# Altium schematic sheet uC.SchDoc: uC
size A3; DrawnBy: MAC; Revision: 0; Project: FotoKite; DrwanWhen: Nov.2013; CheckedWhen: When?
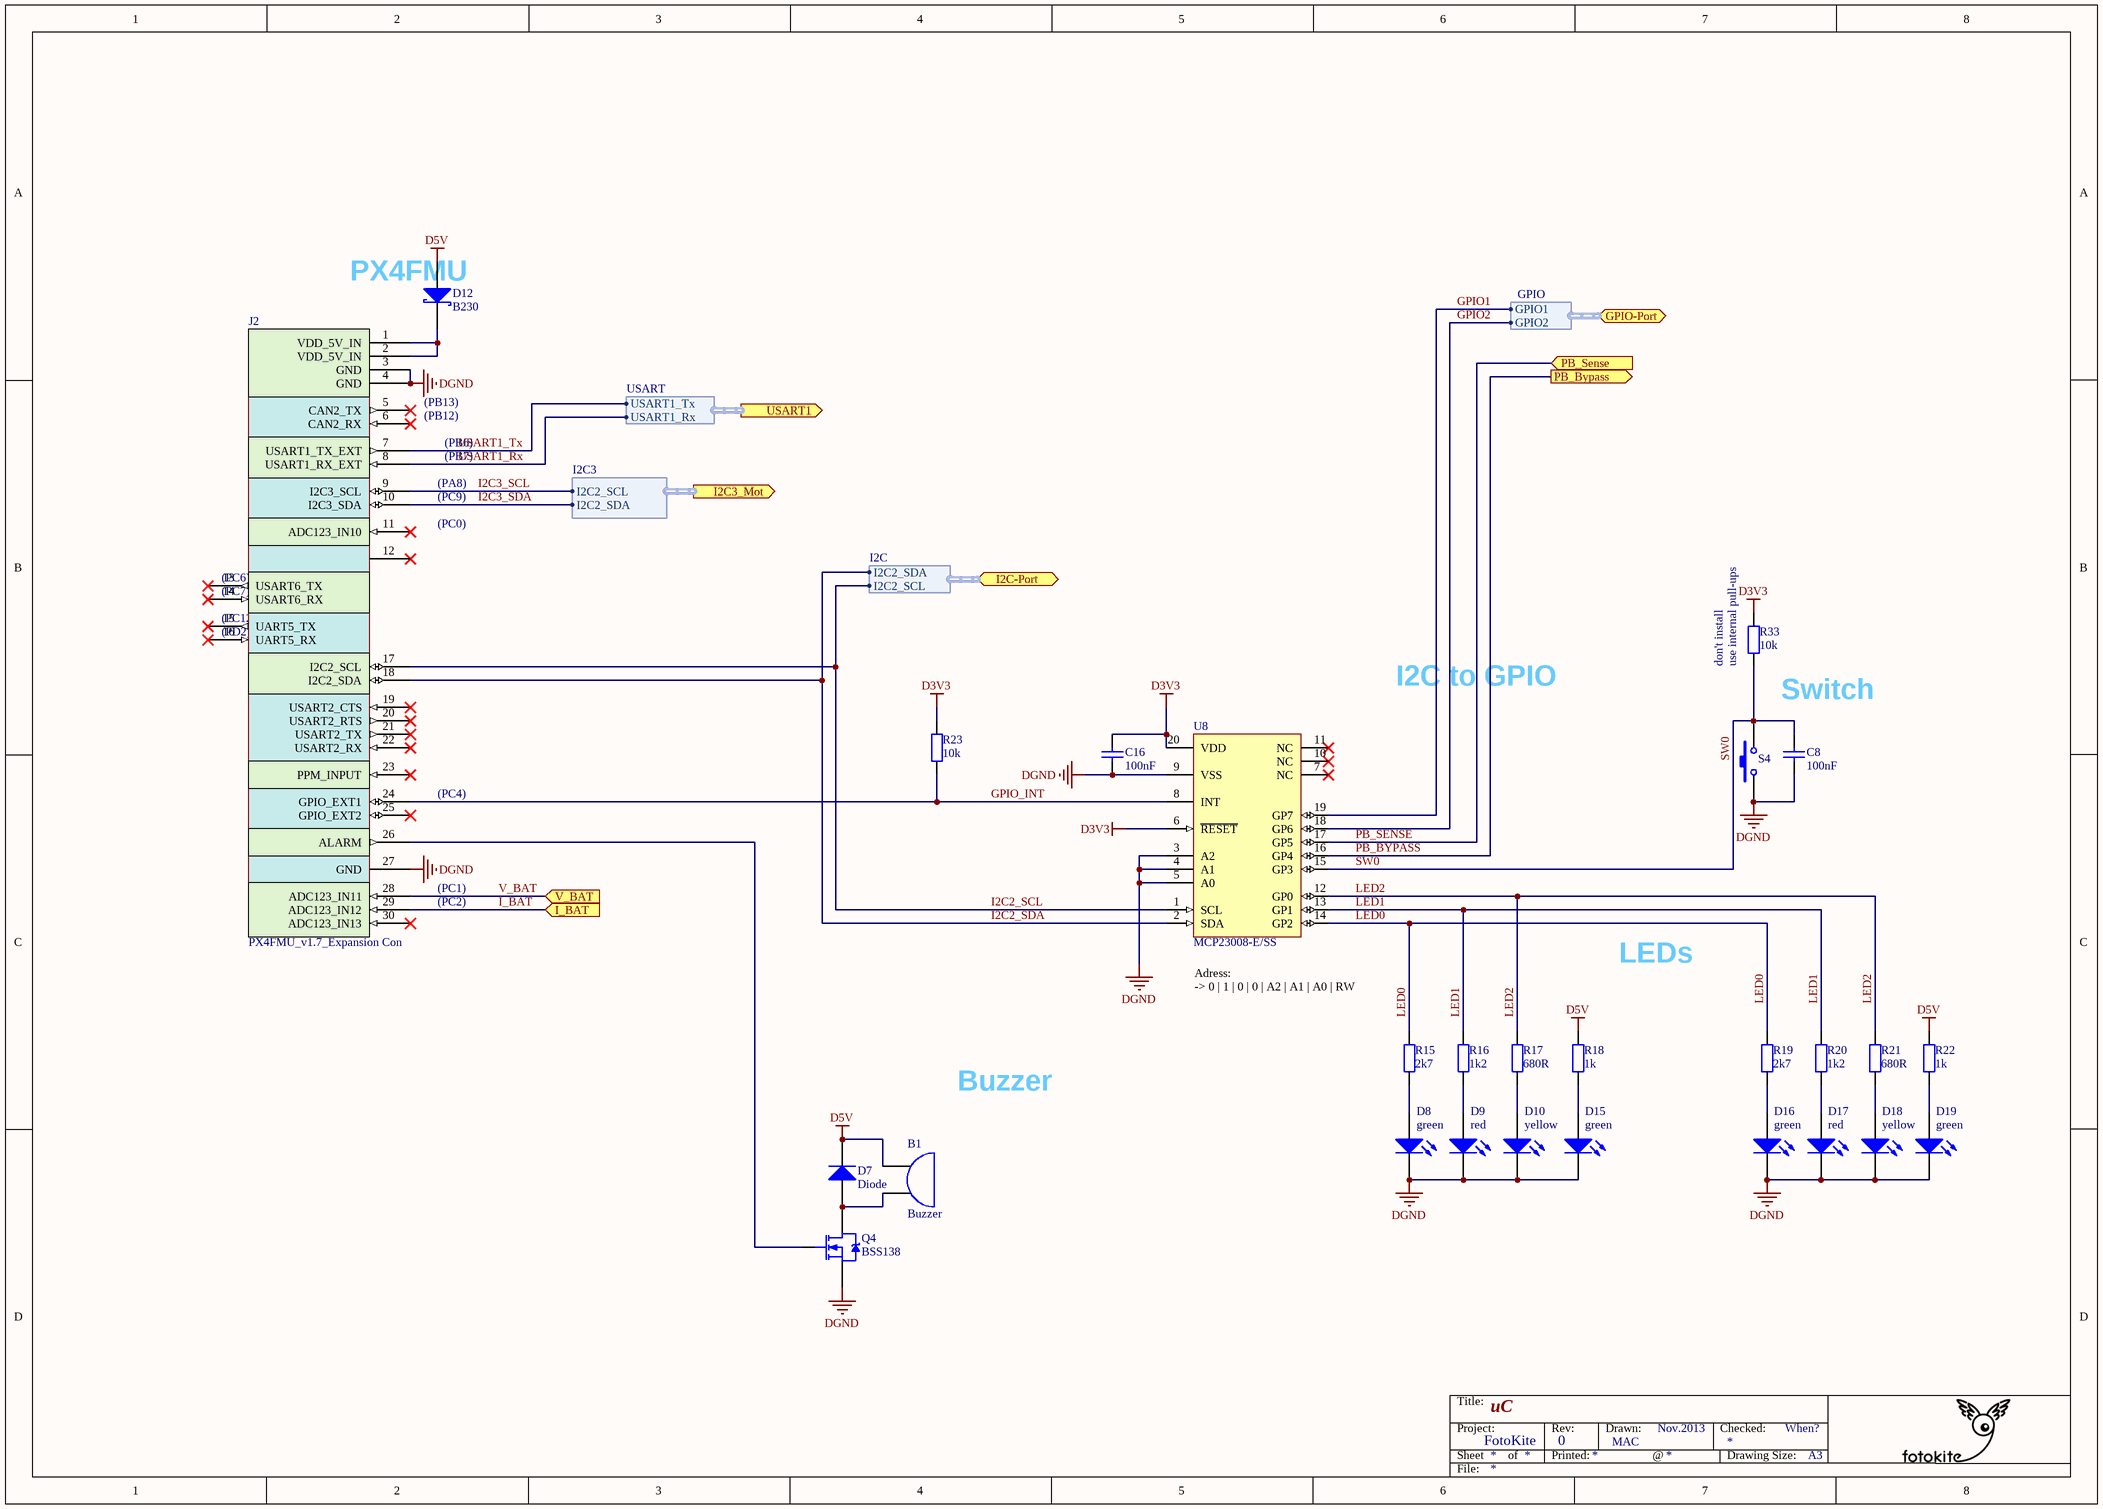
[diagram p0: uC.SchDoc]

## Parts
B1  Buzzer  [Buzzer_SMT-0827-SW-3V-R]
C8  100nF  [CAP_0603i_1608m -N]
C16  100nF  [CAP_0603i_1608m -N]
D7  Diode  [Mini MELF - SOD-80 -N]
D8  Colour: green  [LED_LTST_SIDE]  (hidden comment: Diode LED green)
D9  Colour: red  [LED_LTST_SIDE]  (hidden comment: Diode LED red)
D10  Colour: yellow  [LED_LTST_SIDE]  (hidden comment: Diode LED yellow)
D12  B230  [Diode SMB DO-214aa -N]
D15  Colour: green  [LED_LTST_SIDE]  (hidden comment: Diode LED green)
D16  Colour: green  [LED_LTST_SIDE]  (hidden comment: Diode LED green)
D17  Colour: red  [LED_LTST_SIDE]  (hidden comment: Diode LED red)
D18  Colour: yellow  [LED_LTST_SIDE]  (hidden comment: Diode LED yellow)
D19  Colour: green  [LED_LTST_SIDE]  (hidden comment: Diode LED green)
J2  PX4FMU_v1.7_Expansion Con  [PX4FMU_v1.7_module_sicket]
Q4  BSS138  [SOT23-N]
R15  2k7  [RES_0603i_1608m -N]
R16  1k2  [RES_0603i_1608m -N]
R17  680R  [RES_0603i_1608m -N]
R18  1k  [RES_0603i_1608m -N]
R19  2k7  [RES_0603i_1608m -N]
R20  1k2  [RES_0603i_1608m -N]
R21  680R  [RES_0603i_1608m -N]
R22  1k  [RES_0603i_1608m -N]
R23  10k  [RES_0603i_1608m -N]
R33  10k  Note: don't install  Note2: use internal pull-ups  [RES_0603i_1608m -N]
S4  EVQ-PUB02K  [EVQPU]  (value not drawn)
U8  MCP23008-E/SS  [SSOP-SS20_N]

## Ports
GPIO-Port (harness GPIO), I2C3_Mot (harness I2C3), I2C-Port (harness I2C), I_BAT (in), PB_Bypass (out), PB_Sense, USART1 (harness USART), V_BAT (in)

## Harnesses
I2C3: I2C2_SCL, I2C2_SDA
GPIO: GPIO1, GPIO2
I2C: I2C2_SCL, I2C2_SDA
USART: USART1_Tx, USART1_Rx

## Nets
D3V3: C16.1 R23.2 R33.2 U8.6(~{RESET}) U8.20(VDD)
D5V: B1.1 D7.2(K) D12.1(A) R18.2 R22.2
DGND: C8.1 C16.2 D8.2(K) D9.2(K) D10.2(K) D15.2(K) D16.2(K) D17.2(K) D18.2(K) D19.2(K) J2.3(GND) J2.4(GND) J2.27(GND) Q4.2(S) S4.2 U8.3(A2) U8.4(A1) U8.5(A0) U8.9(VSS)
GPIO1: U8.19(GP7) ; port GPIO-Port.GPIO1
GPIO2: U8.18(GP6) ; port GPIO-Port.GPIO2
GPIO_INT: J2.24(GPIO_EXT1) R23.1 U8.8(INT)
I2C2_SCL: J2.17(I2C2_SCL) U8.1(SCL) ; port I2C-Port.I2C2_SCL
I2C2_SDA: J2.18(I2C2_SDA) U8.2(SDA) ; port I2C-Port.I2C2_SDA
I2C3_SCL: J2.9(I2C3_SCL) ; port I2C3_Mot.I2C2_SCL
I2C3_SDA: J2.10(I2C3_SDA) ; port I2C3_Mot.I2C2_SDA
I_BAT: J2.29(ADC123_IN12) ; port I_BAT
LED0: R15.2 R19.2 U8.14(GP2)
LED1: R16.2 R20.2 U8.13(GP1)
LED2: R17.2 R21.2 U8.12(GP0)
PB_BYPASS: U8.16(GP4) ; port PB_Bypass
PB_SENSE: U8.17(GP5) ; port PB_Sense
SW0: C8.2 R33.1 S4.1 U8.15(GP3)
USART1_Rx: J2.8(USART1_RX_EXT) ; port USART1.USART1_Rx
USART1_Tx: J2.7(USART1_TX_EXT) ; port USART1.USART1_Tx
V_BAT: J2.28(ADC123_IN11) ; port V_BAT
NetB1_2: B1.2 D7.1(A) Q4.3(D)
NetD8_1: D8.1(A) R15.1
NetD9_1: D9.1(A) R16.1
NetD10_1: D10.1(A) R17.1
NetD12_2: D12.2(K) J2.1(VDD_5V_IN) J2.2(VDD_5V_IN)
NetD15_1: D15.1(A) R18.1
NetD16_1: D16.1(A) R19.1
NetD17_1: D17.1(A) R20.1
NetD18_1: D18.1(A) R21.1
NetD19_1: D19.1(A) R22.1
NetJ2_26: J2.26(ALARM) Q4.1(G)

Not connected (* = marked no-connect by the designer): J2 5(CAN2_TX)* 6(CAN2_RX)* 11(ADC123_IN10)* 12* 13(USART6_TX)* 14(USART6_RX)* 15(UART5_TX)* 16(UART5_RX)* 19(USART2_CTS)* 20(USART2_RTS)* 21(USART2_TX)* 22(USART2_RX)* 23(PPM_INPUT)* 25(GPIO_EXT2)* 30(ADC123_IN13)*; U8 7(NC)* 10(NC)* 11(NC)*

## Notes on the sheet
- PX4FMU
- (near J2) (PB13)
- (near J2) (PB12)
- (near J2) (PB6)
- (near J2) (PA8)
- (near J2) (PC9)
- (near J2) (PB7)
- (near J2) (PC6)
- (near J2) (PC0)
- (near J2) (PC7)
- (near J2) (PC12)
- (near J2) (PD2)
- I2C to GPIO
- Switch
- (near J2) (PC4)
- (near J2) (PC1)
- (near J2) (PC2)
- LEDs
- Adress:
  -> 0 | 1 | 0 | 0 | A2 | A1 | A0 | RW
- Buzzer
- Sheet
- Project:
- Title:
- of
- Rev:
- Printed:
- Drawn:
- @
- Checked:
- Drawing Size:
- A3
- File:

## Library data of the parts
B1 = Buzzer: Generic Buzzer; Manufacturer ID: SMT-0827-SW-3V-R; Supplier: digikey: 668-1193-1-ND
C8 C16 = Cap: capacitor
D7 = Diode: Default Diode
D8 D15 D16 D19 = Diode LED: LED; Note: 1V7 / 2mA; Supplier: Digikey: 160-1478-1-ND
D9 D17 = Diode LED: LED; note: 1V8 / 2mA; Supplier: Digikey: 160-1479-1-ND
D10 D18 = Diode LED: LED; Note: 1V8 / 2mA; Supplier: Digikey: 160-1480-1-ND
D12 = Diode  Schottky: Schottky Diode; Manufacturer ID: Diodes Inc: B230-13-F; Note: Alternative: SS24/1; Supplier: digi-key: B230-FDICT-ND
J2 = PX4FMU_v1.7_Expansion Con_1: J2 / J3; Supplier: digikey: 3M9197CT-ND
Q4 = MOSFET-N2: N-Channel MOSFET; Note: Check footprint as it may  differ; Supplier: digikey: BSS138-FDICT-ND; price (1) €: 0.29; price (100) €: 0.1469
R15-R23 R33 = Res: Resistor
S4 = SW PB: Switch; Manufacturer ID: Panasonic: EVQ-PUB02K; Supplier: digi-key: P10848SCT-ND
U8 = CMP-0186-00169-3: 8-Bit I/O Expander with Serial Interface, 20-Pin SSOP, Extended Temperature; PackageVersion: revBB, Aug-2009; Code_JEDEC: MO-150; ComponentLink3URL: http://www.microchip.com/stellent/groups/techpub_sg/documents/packagingspec/en012702.pdf; PackageReference: SSOP-SS20; ComponentLink2Description: Datasheet; ComponentLink1URL: http://www.microchip.com/; ComponentLink2URL: http://ww1.microchip.com/downloads/en/DeviceDoc/21919e.pdf; RevisionNote: Sch corrected.; PackageDescription: 20-Lead Plastic Shrink Small Outline (SS) - 5.3mm Body [SSOP]; ComponentLink1Description: Manufacturer URL; ComponentLink3Description: Package Specification; DatasheetVersion: revE, Aug-2007